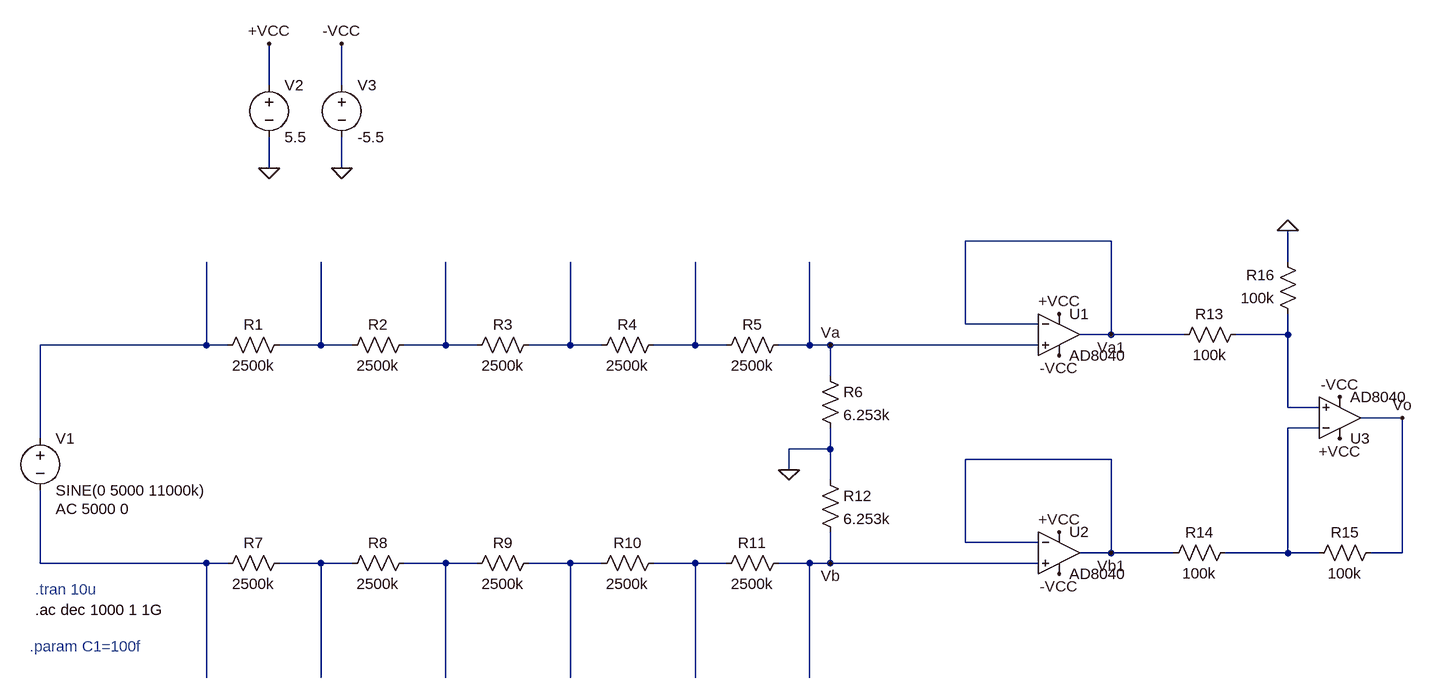
[diagram p0: schematic InputCircuit_Test1.asc]
InputCircuit_Test1.asc, the LTspice schematic file:
Version 4
SHEET 1 1600 680
WIRE -192 -416 -192 -480
WIRE -80 -416 -80 -480
WIRE -192 -288 -192 -336
WIRE -80 -288 -80 -336
WIRE 1104 -176 880 -176
WIRE 1376 -144 1376 -192
WIRE 880 -48 880 -176
WIRE 992 -48 880 -48
WIRE 1104 -32 1104 -176
WIRE 1104 -32 1056 -32
WIRE 1216 -32 1104 -32
WIRE 1376 -32 1376 -64
WIRE 1376 -32 1296 -32
WIRE -288 -16 -288 -144
WIRE -288 -16 -544 -16
WIRE -256 -16 -288 -16
WIRE -112 -16 -112 -144
WIRE -112 -16 -176 -16
WIRE -64 -16 -112 -16
WIRE 80 -16 80 -144
WIRE 80 -16 16 -16
WIRE 128 -16 80 -16
WIRE 272 -16 272 -144
WIRE 272 -16 208 -16
WIRE 320 -16 272 -16
WIRE 464 -16 464 -144
WIRE 464 -16 400 -16
WIRE 512 -16 464 -16
WIRE 640 -16 640 -144
WIRE 640 -16 592 -16
WIRE 672 -16 640 -16
WIRE 992 -16 672 -16
WIRE 672 32 672 -16
WIRE 1376 80 1376 -32
WIRE 1424 80 1376 80
WIRE 1552 96 1488 96
WIRE 1424 112 1376 112
WIRE -544 128 -544 -16
WIRE 672 144 672 112
WIRE 672 144 608 144
WIRE 1104 160 880 160
WIRE 608 176 608 144
WIRE 672 192 672 144
WIRE 880 288 880 160
WIRE 992 288 880 288
WIRE 1104 304 1104 160
WIRE 1104 304 1056 304
WIRE 1200 304 1104 304
WIRE 1376 304 1376 112
WIRE 1376 304 1280 304
WIRE 1424 304 1376 304
WIRE 1552 304 1552 96
WIRE 1552 304 1504 304
WIRE -544 320 -544 208
WIRE -288 320 -544 320
WIRE -256 320 -288 320
WIRE -112 320 -176 320
WIRE -64 320 -112 320
WIRE 80 320 16 320
WIRE 128 320 80 320
WIRE 272 320 208 320
WIRE 320 320 272 320
WIRE 464 320 400 320
WIRE 512 320 464 320
WIRE 640 320 592 320
WIRE 672 320 672 272
WIRE 672 320 640 320
WIRE 992 320 672 320
WIRE -288 496 -288 320
WIRE -112 496 -112 320
WIRE 80 496 80 320
WIRE 272 496 272 320
WIRE 464 496 464 320
WIRE 640 496 640 320
FLAG 672 -16 Va
FLAG 672 320 Vb
FLAG 608 176 0
FLAG -192 -288 0
FLAG -80 -288 0
FLAG -192 -480 +VCC
FLAG -80 -480 -VCC
FLAG 1024 0 -VCC
FLAG 1024 -64 +VCC
FLAG 1024 336 -VCC
FLAG 1024 272 +VCC
FLAG 1104 -32 Va1
FLAG 1104 304 Vb1
FLAG 1456 64 -VCC
FLAG 1456 128 +VCC
FLAG 1376 -192 0
FLAG 1552 96 Vo
SYMBOL res -160 -32 R90
WINDOW 0 0 56 VBottom 2
WINDOW 3 32 56 VTop 2
SYMATTR InstName R1
SYMATTR Value 2500k
SYMATTR SpiceLine tol=0 pwr=1
SYMBOL res 32 -32 R90
WINDOW 0 0 56 VBottom 2
WINDOW 3 32 56 VTop 2
SYMATTR InstName R2
SYMATTR Value 2500k
SYMATTR SpiceLine tol=0 pwr=1
SYMBOL res 224 -32 R90
WINDOW 0 0 56 VBottom 2
WINDOW 3 32 56 VTop 2
SYMATTR InstName R3
SYMATTR Value 2500k
SYMATTR SpiceLine tol=0 pwr=1
SYMBOL res 416 -32 R90
WINDOW 0 0 56 VBottom 2
WINDOW 3 32 56 VTop 2
SYMATTR InstName R4
SYMATTR Value 2500k
SYMATTR SpiceLine tol=0 pwr=1
SYMBOL res 608 -32 R90
WINDOW 0 0 56 VBottom 2
WINDOW 3 32 56 VTop 2
SYMATTR InstName R5
SYMATTR Value 2500k
SYMATTR SpiceLine tol=0 pwr=1
SYMBOL res -160 304 R90
WINDOW 0 0 56 VBottom 2
WINDOW 3 32 56 VTop 2
SYMATTR InstName R7
SYMATTR Value 2500k
SYMATTR SpiceLine tol=0 pwr=1
SYMBOL res 32 304 R90
WINDOW 0 0 56 VBottom 2
WINDOW 3 32 56 VTop 2
SYMATTR InstName R8
SYMATTR Value 2500k
SYMATTR SpiceLine tol=0 pwr=1
SYMBOL res 224 304 R90
WINDOW 0 0 56 VBottom 2
WINDOW 3 32 56 VTop 2
SYMATTR InstName R9
SYMATTR Value 2500k
SYMATTR SpiceLine tol=0 pwr=1
SYMBOL res 416 304 R90
WINDOW 0 0 56 VBottom 2
WINDOW 3 32 56 VTop 2
SYMATTR InstName R10
SYMATTR Value 2500k
SYMATTR SpiceLine tol=0 pwr=1
SYMBOL res 608 304 R90
WINDOW 0 0 56 VBottom 2
WINDOW 3 32 56 VTop 2
SYMATTR InstName R11
SYMATTR Value 2500k
SYMATTR SpiceLine tol=0 pwr=1
SYMBOL voltage -544 112 R0
WINDOW 123 24 124 Left 2
WINDOW 39 0 0 Left 0
SYMATTR InstName V1
SYMATTR Value SINE(0 5000 11000k)
SYMATTR Value2 AC 5000 0
SYMBOL res 656 16 R0
SYMATTR InstName R6
SYMATTR Value 6.253k
SYMBOL res 656 176 R0
SYMATTR InstName R12
SYMATTR Value 6.253k
SYMBOL OpAmps\\AD8040 1024 -96 R0
SYMATTR InstName U1
SYMBOL voltage -192 -432 R0
WINDOW 123 0 0 Left 0
WINDOW 39 0 0 Left 0
SYMATTR InstName V2
SYMATTR Value 5.5
SYMBOL voltage -80 -432 R0
WINDOW 123 0 0 Left 0
WINDOW 39 0 0 Left 0
SYMATTR InstName V3
SYMATTR Value -5.5
SYMBOL OpAmps\\AD8040 1024 240 R0
SYMATTR InstName U2
SYMBOL OpAmps\\AD8040 1456 160 M180
SYMATTR InstName U3
SYMBOL res 1312 -48 R90
WINDOW 0 0 56 VBottom 2
WINDOW 3 32 56 VTop 2
SYMATTR InstName R13
SYMATTR Value 100k
SYMBOL res 1296 288 R90
WINDOW 0 0 56 VBottom 2
WINDOW 3 32 56 VTop 2
SYMATTR InstName R14
SYMATTR Value 100k
SYMBOL res 1520 288 R90
WINDOW 0 0 56 VBottom 2
WINDOW 3 32 56 VTop 2
SYMATTR InstName R15
SYMATTR Value 100k
SYMBOL res 1392 -48 R180
WINDOW 0 36 76 Left 2
WINDOW 3 36 40 Left 2
SYMATTR InstName R16
SYMATTR Value 100k
TEXT -552 360 Left 2 ;.tran 10u
TEXT -552 392 Left 2 !.ac dec 1000 1 1G
TEXT -560 448 Left 2 ;.param C1=100f

The netlist it stands for:
* InputCircuit_Test1.asc
R1 N003 N002 2500k tol=0 pwr=1
R2 N004 N003 2500k tol=0 pwr=1
R3 N005 N004 2500k tol=0 pwr=1
R4 N006 N005 2500k tol=0 pwr=1
R5 Va N006 2500k tol=0 pwr=1
R7 N009 N008 2500k tol=0 pwr=1
R8 N010 N009 2500k tol=0 pwr=1
R9 N011 N010 2500k tol=0 pwr=1
R10 N012 N011 2500k tol=0 pwr=1
R11 Vb N012 2500k tol=0 pwr=1
V1 N002 N008 SINE(0 5000 11000k) AC 5000 0
R6 Va 0 6.253k
R12 0 Vb 6.253k
XU1 Va Va1 +VCC -VCC Va1 AD8040  ; pins In+ In- V+ V- OUT
V2 +VCC 0 5.5
V3 -VCC 0 -5.5
XU2 Vb Vb1 +VCC -VCC Vb1 AD8040  ; pins In+ In- V+ V- OUT
XU3 N001 N007 +VCC -VCC Vo AD8040  ; pins In+ In- V+ V- OUT
R13 N001 Va1 100k
R14 N007 Vb1 100k
R15 Vo N007 100k
R16 N001 0 100k
* .tran 10u
.ac dec 1000 1 1G
* .param C1=100f
.backanno
.end